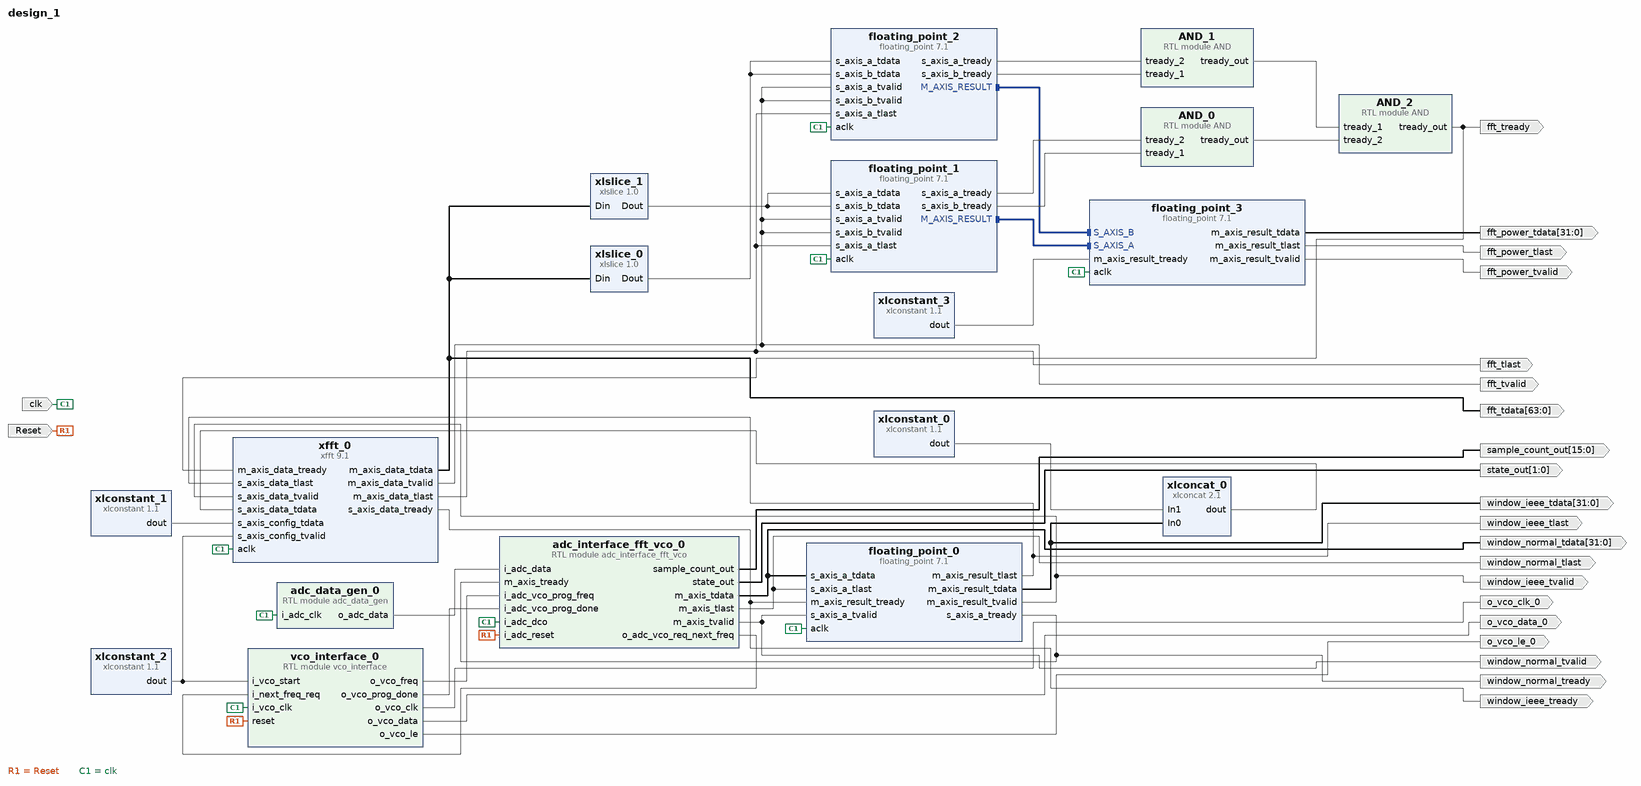
[diagram p0: block diagram of the top level]
# Vivado block design design_1, xc7z020clg484-1, Vivado 2021.2
create_bd_design design_1

create_bd_port -dir I -type clk clk
set_property -dict {CONFIG.FREQ_HZ 100000000} [get_bd_ports clk]
create_bd_port -dir I -type rst Reset
set_property -dict {CONFIG.POLARITY ACTIVE_HIGH} [get_bd_ports Reset]
create_bd_port -dir O o_vco_le_0
create_bd_port -dir O -type clk o_vco_clk_0
create_bd_port -dir O o_vco_data_0
create_bd_port -dir O -from 1 -to 0 state_out
create_bd_port -dir O -from 31 -to 0 window_normal_tdata
create_bd_port -dir O window_normal_tlast
create_bd_port -dir O window_normal_tvalid
create_bd_port -dir O window_normal_tready
create_bd_port -dir O -from 31 -to 0 fft_power_tdata
create_bd_port -dir O fft_power_tlast
create_bd_port -dir O fft_power_tvalid
create_bd_port -dir O -from 31 -to 0 window_ieee_tdata
create_bd_port -dir O window_ieee_tlast
create_bd_port -dir O window_ieee_tready
create_bd_port -dir O window_ieee_tvalid
create_bd_port -dir O -from 63 -to 0 fft_tdata
create_bd_port -dir O fft_tlast
create_bd_port -dir O fft_tready
create_bd_port -dir O fft_tvalid
create_bd_port -dir O -from 15 -to 0 sample_count_out

create_bd_cell -type module -reference adc_data_gen adc_data_gen_0
create_bd_cell -type module -reference vco_interface vco_interface_0
create_bd_cell -type ip -vlnv xilinx.com:ip:xfft:9.1 xfft_0
set_property -dict [list \
  CONFIG.data_format floating_point \
  CONFIG.number_of_stages_using_block_ram_for_data_and_phase_factors 3 \
  CONFIG.output_ordering natural_order \
  CONFIG.phase_factor_width 24 \
  CONFIG.target_clock_frequency 100 \
  CONFIG.target_data_throughput 100 \
] [get_bd_cells xfft_0]
create_bd_cell -type ip -vlnv xilinx.com:ip:floating_point:7.1 floating_point_0
set_property -dict [list \
  CONFIG.C_Accum_Input_Msb 32 \
  CONFIG.C_Accum_Lsb -31 \
  CONFIG.C_Accum_Msb 32 \
  CONFIG.C_Latency 7 \
  CONFIG.C_Mult_Usage No_Usage \
  CONFIG.C_Rate 1 \
  CONFIG.C_Result_Exponent_Width 8 \
  CONFIG.C_Result_Fraction_Width 24 \
  CONFIG.Has_A_TLAST true \
  CONFIG.Operation_Type Fixed_to_float \
  CONFIG.RESULT_TLAST_Behv Pass_A_TLAST \
  CONFIG.Result_Precision_Type Single \
] [get_bd_cells floating_point_0]
create_bd_cell -type ip -vlnv xilinx.com:ip:xlconcat:2.1 xlconcat_0
set_property -dict {CONFIG.IN0_WIDTH 32 CONFIG.IN1_WIDTH 32} [get_bd_cells xlconcat_0]
create_bd_cell -type ip -vlnv xilinx.com:ip:xlconstant:1.1 xlconstant_0
set_property -dict {CONFIG.CONST_VAL 0 CONFIG.CONST_WIDTH 32} [get_bd_cells xlconstant_0]
create_bd_cell -type ip -vlnv xilinx.com:ip:xlconstant:1.1 xlconstant_1
set_property -dict {CONFIG.CONST_WIDTH 16} [get_bd_cells xlconstant_1]
create_bd_cell -type ip -vlnv xilinx.com:ip:xlconstant:1.1 xlconstant_2
create_bd_cell -type ip -vlnv xilinx.com:ip:floating_point:7.1 floating_point_1
set_property -dict [list \
  CONFIG.C_Latency 9 \
  CONFIG.C_Mult_Usage Full_Usage \
  CONFIG.C_Rate 1 \
  CONFIG.C_Result_Exponent_Width 8 \
  CONFIG.C_Result_Fraction_Width 24 \
  CONFIG.Has_A_TLAST true \
  CONFIG.Operation_Type Multiply \
  CONFIG.RESULT_TLAST_Behv Pass_A_TLAST \
  CONFIG.Result_Precision_Type Single \
] [get_bd_cells floating_point_1]
create_bd_cell -type ip -vlnv xilinx.com:ip:floating_point:7.1 floating_point_2
set_property -dict [list \
  CONFIG.C_Latency 9 \
  CONFIG.C_Mult_Usage Full_Usage \
  CONFIG.C_Rate 1 \
  CONFIG.C_Result_Exponent_Width 8 \
  CONFIG.C_Result_Fraction_Width 24 \
  CONFIG.Has_A_TLAST true \
  CONFIG.Operation_Type Multiply \
  CONFIG.RESULT_TLAST_Behv Pass_A_TLAST \
  CONFIG.Result_Precision_Type Single \
] [get_bd_cells floating_point_2]
create_bd_cell -type ip -vlnv xilinx.com:ip:xlslice:1.0 xlslice_0
set_property -dict {CONFIG.DIN_FROM 63 CONFIG.DIN_TO 32 CONFIG.DIN_WIDTH 64 CONFIG.DOUT_WIDTH 32} [get_bd_cells xlslice_0]
create_bd_cell -type ip -vlnv xilinx.com:ip:xlslice:1.0 xlslice_1
set_property -dict {CONFIG.DIN_FROM 31 CONFIG.DIN_WIDTH 64 CONFIG.DOUT_WIDTH 32} [get_bd_cells xlslice_1]
create_bd_cell -type module -reference AND AND_0
create_bd_cell -type module -reference AND AND_1
create_bd_cell -type module -reference AND AND_2
create_bd_cell -type ip -vlnv xilinx.com:ip:floating_point:7.1 floating_point_3
set_property -dict [list \
  CONFIG.Add_Sub_Value Add \
  CONFIG.Has_A_TLAST true \
  CONFIG.Has_B_TLAST true \
  CONFIG.RESULT_TLAST_Behv AND_all_TLASTs \
] [get_bd_cells floating_point_3]
create_bd_cell -type ip -vlnv xilinx.com:ip:xlconstant:1.1 xlconstant_3
create_bd_cell -type module -reference adc_interface_fft_vco adc_interface_fft_vco_0

# ---- connections ----

connect_bd_intf_net [get_bd_intf_pins floating_point_1/M_AXIS_RESULT] [get_bd_intf_pins floating_point_3/S_AXIS_A]
connect_bd_intf_net [get_bd_intf_pins floating_point_2/M_AXIS_RESULT] [get_bd_intf_pins floating_point_3/S_AXIS_B]
connect_bd_net [get_bd_pins AND_0/tready_out] [get_bd_pins AND_2/tready_2]
connect_bd_net [get_bd_pins AND_1/tready_out] [get_bd_pins AND_2/tready_1]
connect_bd_net [get_bd_pins AND_2/tready_out] [get_bd_ports fft_tready] [get_bd_pins xfft_0/m_axis_data_tready]
connect_bd_net [get_bd_ports Reset] [get_bd_pins vco_interface_0/reset] [get_bd_pins adc_interface_fft_vco_0/i_adc_reset]
connect_bd_net [get_bd_pins adc_data_gen_0/o_adc_data] [get_bd_pins adc_interface_fft_vco_0/i_adc_data]
connect_bd_net [get_bd_pins adc_interface_fft_vco_0/m_axis_tdata] [get_bd_ports window_normal_tdata] [get_bd_pins floating_point_0/s_axis_a_tdata]
connect_bd_net [get_bd_pins adc_interface_fft_vco_0/m_axis_tlast] [get_bd_ports window_normal_tlast] [get_bd_pins floating_point_0/s_axis_a_tlast]
connect_bd_net [get_bd_pins adc_interface_fft_vco_0/m_axis_tvalid] [get_bd_ports window_normal_tvalid] [get_bd_pins floating_point_0/s_axis_a_tvalid]
connect_bd_net [get_bd_pins adc_interface_fft_vco_0/o_adc_vco_req_next_freq] [get_bd_pins vco_interface_0/i_next_freq_req]
connect_bd_net [get_bd_pins adc_interface_fft_vco_0/sample_count_out] [get_bd_ports sample_count_out]
connect_bd_net [get_bd_pins adc_interface_fft_vco_0/state_out] [get_bd_ports state_out]
connect_bd_net [get_bd_ports clk] \
  [get_bd_pins adc_data_gen_0/i_adc_clk] [get_bd_pins vco_interface_0/i_vco_clk] [get_bd_pins floating_point_0/aclk] \
  [get_bd_pins xfft_0/aclk] [get_bd_pins floating_point_2/aclk] [get_bd_pins floating_point_1/aclk] \
  [get_bd_pins floating_point_3/aclk] [get_bd_pins adc_interface_fft_vco_0/i_adc_dco]
connect_bd_net [get_bd_pins floating_point_0/m_axis_result_tdata] [get_bd_ports window_ieee_tdata] [get_bd_pins xlconcat_0/In0]
connect_bd_net [get_bd_pins floating_point_0/m_axis_result_tlast] [get_bd_ports window_ieee_tlast] [get_bd_pins xfft_0/s_axis_data_tlast]
connect_bd_net [get_bd_pins floating_point_0/m_axis_result_tvalid] [get_bd_ports window_ieee_tvalid] [get_bd_pins xfft_0/s_axis_data_tvalid]
connect_bd_net [get_bd_pins floating_point_0/s_axis_a_tready] [get_bd_ports window_normal_tready] [get_bd_pins adc_interface_fft_vco_0/m_axis_tready]
connect_bd_net [get_bd_pins floating_point_1/s_axis_a_tready] [get_bd_pins AND_0/tready_2]
connect_bd_net [get_bd_pins floating_point_1/s_axis_b_tready] [get_bd_pins AND_0/tready_1]
connect_bd_net [get_bd_pins floating_point_2/s_axis_a_tready] [get_bd_pins AND_1/tready_2]
connect_bd_net [get_bd_pins floating_point_2/s_axis_b_tready] [get_bd_pins AND_1/tready_1]
connect_bd_net [get_bd_pins floating_point_3/m_axis_result_tdata] [get_bd_ports fft_power_tdata]
connect_bd_net [get_bd_pins floating_point_3/m_axis_result_tlast] [get_bd_ports fft_power_tlast]
connect_bd_net [get_bd_pins floating_point_3/m_axis_result_tvalid] [get_bd_ports fft_power_tvalid]
connect_bd_net [get_bd_pins vco_interface_0/o_vco_clk] [get_bd_ports o_vco_clk_0]
connect_bd_net [get_bd_pins vco_interface_0/o_vco_data] [get_bd_ports o_vco_data_0]
connect_bd_net [get_bd_pins vco_interface_0/o_vco_freq] [get_bd_pins adc_interface_fft_vco_0/i_adc_vco_prog_freq]
connect_bd_net [get_bd_pins vco_interface_0/o_vco_le] [get_bd_ports o_vco_le_0]
connect_bd_net [get_bd_pins vco_interface_0/o_vco_prog_done] [get_bd_pins adc_interface_fft_vco_0/i_adc_vco_prog_done]
connect_bd_net [get_bd_pins xfft_0/m_axis_data_tdata] [get_bd_ports fft_tdata] [get_bd_pins xlslice_0/Din] [get_bd_pins xlslice_1/Din]
connect_bd_net [get_bd_pins xfft_0/m_axis_data_tlast] \
  [get_bd_ports fft_tlast] [get_bd_pins floating_point_1/s_axis_a_tlast] [get_bd_pins floating_point_2/s_axis_a_tlast]
connect_bd_net [get_bd_pins xfft_0/m_axis_data_tvalid] \
  [get_bd_ports fft_tvalid] [get_bd_pins floating_point_1/s_axis_a_tvalid] [get_bd_pins floating_point_1/s_axis_b_tvalid] \
  [get_bd_pins floating_point_2/s_axis_a_tvalid] [get_bd_pins floating_point_2/s_axis_b_tvalid]
connect_bd_net [get_bd_pins xfft_0/s_axis_data_tready] [get_bd_ports window_ieee_tready] [get_bd_pins floating_point_0/m_axis_result_tready]
connect_bd_net [get_bd_pins xlconcat_0/dout] [get_bd_pins xfft_0/s_axis_data_tdata]
connect_bd_net [get_bd_pins xlconstant_0/dout] [get_bd_pins xlconcat_0/In1]
connect_bd_net [get_bd_pins xlconstant_1/dout] [get_bd_pins xfft_0/s_axis_config_tdata]
connect_bd_net [get_bd_pins xlconstant_2/dout] [get_bd_pins xfft_0/s_axis_config_tvalid] [get_bd_pins vco_interface_0/i_vco_start]
connect_bd_net [get_bd_pins xlconstant_3/dout] [get_bd_pins floating_point_3/m_axis_result_tready]
connect_bd_net [get_bd_pins xlslice_0/Dout] [get_bd_pins floating_point_2/s_axis_a_tdata] [get_bd_pins floating_point_2/s_axis_b_tdata]
connect_bd_net [get_bd_pins xlslice_1/Dout] [get_bd_pins floating_point_1/s_axis_a_tdata] [get_bd_pins floating_point_1/s_axis_b_tdata]

validate_bd_design
save_bd_design
